# Altium project MSP1.PrjPcb
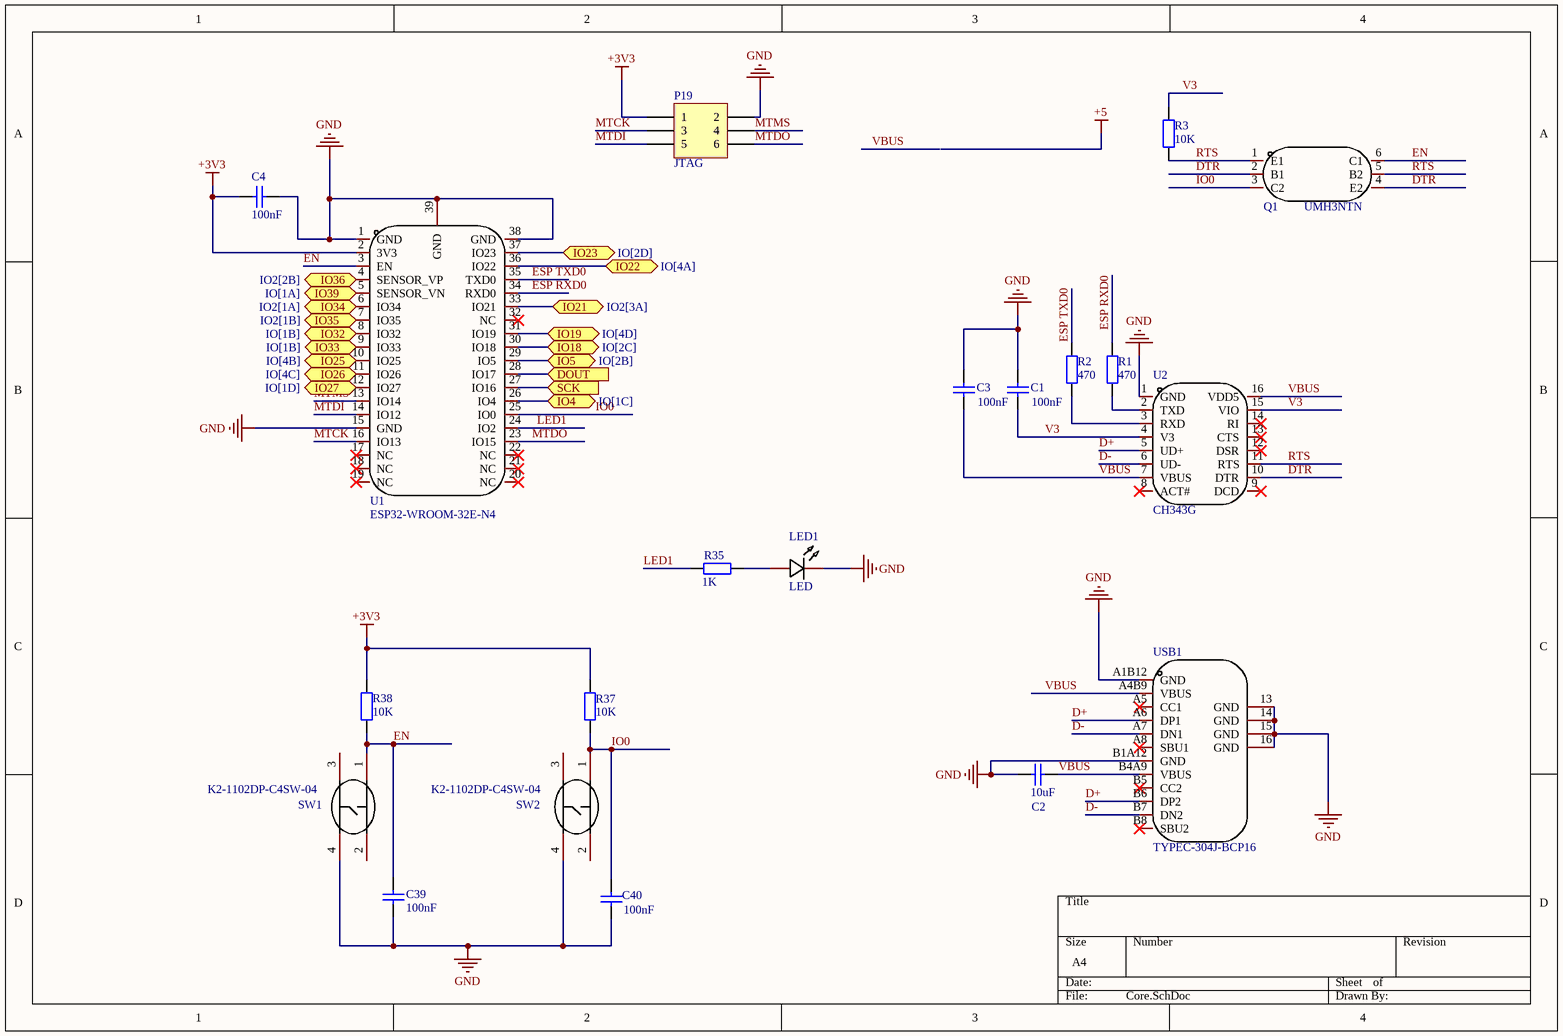
[diagram p0: Core.SchDoc]
5 sheets, 151 parts. Net scope: flat (ports and power ports of the same name join across sheets).
Board files: PCB1.PcbDoc, PCB2.PcbDoc
Sheets:
  Core.SchDoc
  Sensor.SchDoc
  Power.SchDoc
  IO.SchDoc
  IO2.SchDoc

## Sheet Core.SchDoc
size A4; SheetNumber: 1; SheetTotal: 5; SPICEModelCacheADNSXBRB: <root> / <DocumentId>ADNSXBRB</DocumentId> / </root>

### Parts
C1  value 100nF  [RAD-0.3]  (hidden comment: Cap)
C2  value 10uF  [RAD-0.3]  (hidden comment: Cap)
C3  value 100nF  [RAD-0.3]  (hidden comment: Cap)
C4  value 100nF  [RAD-0.3]  (hidden comment: Cap)
C39  value 100nF  [RAD-0.3]  (hidden comment: Cap)
C40  value 100nF  [RAD-0.3]  (hidden comment: Cap)
LED1  Name: LED  [LED-TH_BD5.0-P2.54-FD]  (hidden comment: HL-503S45FC)
P19  JTAG  [HDR2X3]
Q1  UMH3NTN  [SOT-363_L2.0-W1.3-P0.65-LS2.1-TL]
R1  value 470  [AXIAL-0.4]  (hidden comment: Res2)
R2  value 470  [AXIAL-0.4]  (hidden comment: Res2)
R3  value 10K  [AXIAL-0.4]  (hidden comment: Res2)
R35  value 1K  [AXIAL-0.4]  (hidden comment: Res2)
R37  value 10K  [AXIAL-0.4]  (hidden comment: Res2)
R38  value 10K  [AXIAL-0.4]  (hidden comment: Res2)
SW1  K2-1102DP-C4SW-04  [KEY-TH_4P-L6.0-W6.0-P4.50-LS6.50]
SW2  K2-1102DP-C4SW-04  [KEY-TH_4P-L6.0-W6.0-P4.50-LS6.50]
U1  ESP32-WROOM-32E-N4  [WIFI-SMD_ESP32-WROOM-32E]
U2  CH343G  [SOP-16_L10.0-W3.9-P1.27-LS6.0-BL]
USB1  TYPEC-304J-BCP16  [USB-C-SMD_TYPEC-304J-BCP16]

### Ports
DOUT (in, see Sensor[3A]), IO4 (bidir, see IO[1C]), IO5 (bidir, see IO[2B]), IO18 (bidir, see IO[2C]), IO19 (bidir, see IO[4D]), IO21 (bidir, see IO2[3A]), IO22 (bidir, see IO[4A]), IO23 (bidir, see IO[2D]), IO25 (bidir, see IO[4B]), IO26 (bidir, see IO[4C]), IO27 (bidir, see IO[1D]), IO32 (bidir, see IO[1B]), IO33 (bidir, see IO[1B]), IO34 (bidir, see IO2[1A]), IO35 (bidir, see IO2[1B]), IO36 (bidir, see IO2[2B]), IO39 (bidir, see IO[1A]), SCK (in, see Sensor[3A])

### Nets
+3V3: C4.2 P19.1 R37.2 R38.2 U1.2(3V3)
GND: C1.2 C2.2 C3.2 C4.1 C39.1 C40.1 LED1.2 P19.2 SW1.4 SW2.4 U1.1(GND) U1.15(GND) U1.38(GND) U1.39(GND) U2.1(GND) USB1.13(GND) USB1.14(GND) USB1.15(GND) USB1.16(GND) USB1.A1B12(GND) USB1.B1A12(GND)
D+: U2.5(UD+) USB1.A6(DP1) USB1.B6(DP2)
D-: U2.6(UD-) USB1.A7(DN1) USB1.B7(DN2)
DTR: Q1.2(B1) Q1.4(E2) U2.10(DTR)
EN: C39.2 Q1.6(C1) R38.1 SW1.1 U1.3(EN)
ESP RXD0: R1.2 U1.34(RXD0)
ESP TXD0: R2.2 U1.35(TXD0)
IO0: C40.2 Q1.3(C2) R37.1 SW2.1 U1.25(IO0)
LED1: R35.1 U1.24(IO2)
MTCK: P19.3 U1.16(IO13)
MTDI: P19.5 U1.14(IO12)
MTDO: P19.6 U1.23(IO15)
MTMS: P19.4 U1.13(IO14)
RTS: Q1.1(E1) Q1.5(B2) R3.1 U2.11(RTS)
V3: C1.1 R3.2 U2.4(V3) U2.15(VIO)
VBUS: C2.1 C3.1 U2.7(VBUS) U2.16(VDD5) USB1.A4B9(VBUS) USB1.B4A9(VBUS)
NetC33_2: U1.26(IO4) ; port IO4
NetC34_2: U1.12(IO27) ; port IO27
NetC35_2: U1.11(IO26) ; port IO26
NetC41_1: U1.36(IO22) ; port IO22
NetC42_1: U1.6(IO34) ; port IO34
NetC44_2: U1.7(IO35) ; port IO35
NetC45_2: U1.29(IO5) ; port IO5
NetC47_2: U1.37(IO23) ; port IO23
NetC51_2: U1.33(IO21) ; port IO21
NetLED1_1: LED1.1 R35.2
NetP5_1: U1.5(SENSOR_VN) ; port IO39
NetP6_1: U1.8(IO32) ; port IO32
NetP7_1: U1.9(IO33) ; port IO33
NetP14_1: U1.30(IO18) ; port IO18
NetP16_1: U1.10(IO25) ; port IO25
NetP18_1: U1.31(IO19) ; port IO19
NetP26_2: U1.4(SENSOR_VP) ; port IO36
NetR1_1: R1.1 U2.2(TXD)
NetR2_1: R2.1 U2.3(RXD)
NetU1_27: U1.27(IO16) ; port SCK
NetU1_28: U1.28(IO17) ; port DOUT

Not connected (* = marked no-connect by the designer): SW1 2 3; SW2 2 3; U1 17(NC)* 18(NC)* 19(NC)* 20(NC)* 21(NC)* 22(NC)* 32(NC)*; U2 8(ACT#)* 9(DCD)* 12(DSR)* 13(CTS)* 14(RI)*; USB1 A5(CC1)* A8(SBU1)* B5(CC2)* B8(SBU2)*

### Library data of the parts
C1-C4 C39 C40 = Cap: Capacitor; Published: 8-Jun-2000; LatestRevisionDate: 17-Jul-2002; LatestRevisionNote: Re-released for DXP Platform.; PackageReference: RAD-0.3; Publisher: Altium Limited; PackageDescription: Radial Cap, Thru-Hole; 2 Leads; 0.3 in Pin Spacing
LED1 = HL-503S45FC: Manufacturer: HONGLITRONIC(鸿利光电); Add into BOM: yes; Lamp Holder Type: 5mm圆形灯头; Emitted Color: 红色; Forward Voltage (VF): 2.2V; Power Dissipation: 66mW; Forward Current: 20mA; Dominant Wavelength: 617nm~627nm; Lens Color: 无色透明透镜; Luminous Intensity: 10750mcd; Viewing Angle: 15°; Symbol: HL-503S45FC; Device: HL-503S45FC; Supplier: LCSC; Supplier Part: C568942; Manufacturer Part: HL-503S45FC; JLCPCB Part Class: 扩展库; LCSC Part Name: HL-503S45FC; Supplier Footprint: 插件,D=5mm; Datasheet: https://atta.szlcsc.com/upload/public/pdf/source/20200630/C568942_DE1B88CAD7C81208DB145E6C2FD02F7C.pdf; Convert to PCB: yes; Peak Wavelength: -; Diode Configuration: -; Color Temperature: -; Mounting Sytle: -; Operating Temperature: -30℃~+80℃
P19 = Header 3X2: Header, 3-Pin, Dual row; LatestRevisionDate: 17-Jul-2002; LatestRevisionNote: Re-released for DXP Platform.; Publisher: Altium Limited
Q1 = UMH3NTN: Manufacturer: ROHM(罗姆); Add into BOM: yes; Collector-Emitter Breakdown Voltage (Vceo): 50V; Collector Current (Ic): 100mA; Power Dissipation (Pd): 150mW; DC Current Gain (hFE@Ic,Vce): 100@1mA,5V; Symbol: UMH3NTN; Device: UMH3NTN; LCSC Part Name: 耐压:50V 电流:100mA; Supplier Part: C123008; Manufacturer Part: UMH3NTN; Supplier Footprint: SOT-363; JLCPCB Part Class: 扩展库; Datasheet: https://atta.szlcsc.com/upload/public/pdf/source/20170726/C123008_1501054486996843958.pdf; Supplier: LCSC; Convert to PCB: yes; Transistor Type: -; Name: UMH3NTN
R1-R3 R35 R37 R38 = Res2: Resistor; Published: 8-Jun-2000; LatestRevisionDate: 17-Jul-2002; LatestRevisionNote: Re-released for DXP Platform.; PackageReference: AXIAL-0.4; Publisher: Altium Limited; PackageDescription: Axial Device, Thru-Hole; 2 Leads; 0.4 in Pin Spacing
SW1 SW2 = K2-1102DP-C4SW-04: Manufacturer: 韩国韩荣; Add into BOM: yes; Circuit: 单刀单掷; Actuator Style: 圆形按钮; Operating Force: 2.5N; Switch Length: 6mm; Switch Height: 5mm; Contact Current: 50mA; Voltage Rating (DC): 12V; Insulation Resistance: 100MΩ; Mechanical Life: 10万次; Symbol: K2-1102DP-C4SW-04; Device: K2-1102DP-C4SW-04; LCSC Part Name: 轻触按键开关6*6*5; Supplier Part: C110153; Manufacturer Part: K2-1102DP-C4SW-04; Supplier Footprint: 插件; JLCPCB Part Class: 扩展库; Datasheet: https://atta.szlcsc.com/upload/public/pdf/source/20210810/D0CD9D77408EACA829A5E533AC6E5B1E.pdf; Supplier: LCSC; Convert to PCB: yes; Mounting Style: 直插; Switch Width: 6mm; With Lamp: -; Operating Temperature: -25℃~+85℃; K2-1102DP-C4SW-04: K2-1102DP-C4SW-04
U1 = ESP32-WROOM-32E-N4: Manufacturer: ESPRESSIF(乐鑫); Symbol: ESP32-WROOM-32E(4MB); Add into BOM: yes; Device: ESP32-WROOM-32E-N4; LCSC Part Name: 通用型Wi-Fi+BT+BLE MCU模组; Supplier Part: C701341; Manufacturer Part: ESP32-WROOM-32E-N4; Supplier Footprint: SMD,18x25.5mm; JLCPCB Part Class: 扩展库; Datasheet: https://atta.szlcsc.com/upload/public/pdf/source/20220601/0020821B65DE5740BBACA5FACC5CF3B6.pdf; Supplier: LCSC; Convert to PCB: yes; ESP32-WROOM-32E-N4: ESP32-WROOM-32E-N4
U2 = CH343G: Manufacturer: WCH(南京沁恒); Add into BOM: yes; Symbol: CH343G; Device: CH343G; Supplier: LCSC; Supplier Part: C2844153; Manufacturer Part: CH343G; JLCPCB Part Class: 扩展库; LCSC Part Name: CH343G; Supplier Footprint: SOP-16; Datasheet: https://atta.szlcsc.com/upload/public/pdf/source/20211010/C2846043_7FA705E1F14A2906F6A2AFA45FA28209.pdf; Convert to PCB: yes; Applications Function: -; Protocol: -; Name: CH343G
USB1 = TYPEC-304J-BCP16: Manufacturer: XUNPU(讯普); Add into BOM: yes; Connector Type: Type-C; Gender: 母; Number of Ports: 1; Number of Contacts: 16P; Current Rating - Power (Max): 5A; Soldering Temperature(Max): 260℃; Symbol: TYPEC-304J-BCP16; Device: TYPEC-304J-BCP16; Supplier: LCSC; Supplier Part: C2835315; Manufacturer Part: TYPEC-304J-BCP16; JLCPCB Part Class: 扩展库; LCSC Part Name: Type-C 母 卧贴; Supplier Footprint: SMD; Datasheet: https://atta.szlcsc.com/upload/public/pdf/source/20210528/C2835315_A76BD3CF9329D12B6041421AD23BFD66.pdf; Convert to PCB: yes; Standard: USB 3.1; Mounting Style: 卧贴; Operating Temperature Range: -40℃~+85℃; Name: TYPEC-304J-BCP16

## Sheet Sensor.SchDoc
size A4; SheetNumber: 2; SheetTotal: 5; SPICEModelCacheXYVLXKKP: <root> / <DocumentId>XYVLXKKP</DocumentId> / <CacheFrame Number="0"> / <Model Name="2n3904" Kind="MDL"> / <Text>*2N3904 / *Si 310mW  40V 200mA 300MHz pkg:TO-92B 1,2,3 / .MODEL 2N3904 NPN(IS=1.4E-14 BF=300 VAF=100 IKF=0.025 ISE=3E-13 / + BR=7.5 RC=2.4 CJE=4.5E-12 TF=4E-10 CJC=3.5E-12 TR=2.1E-8 XTB=1.5 KF=9E-16 )</Text> / </Model> / </CacheFrame> / </root>
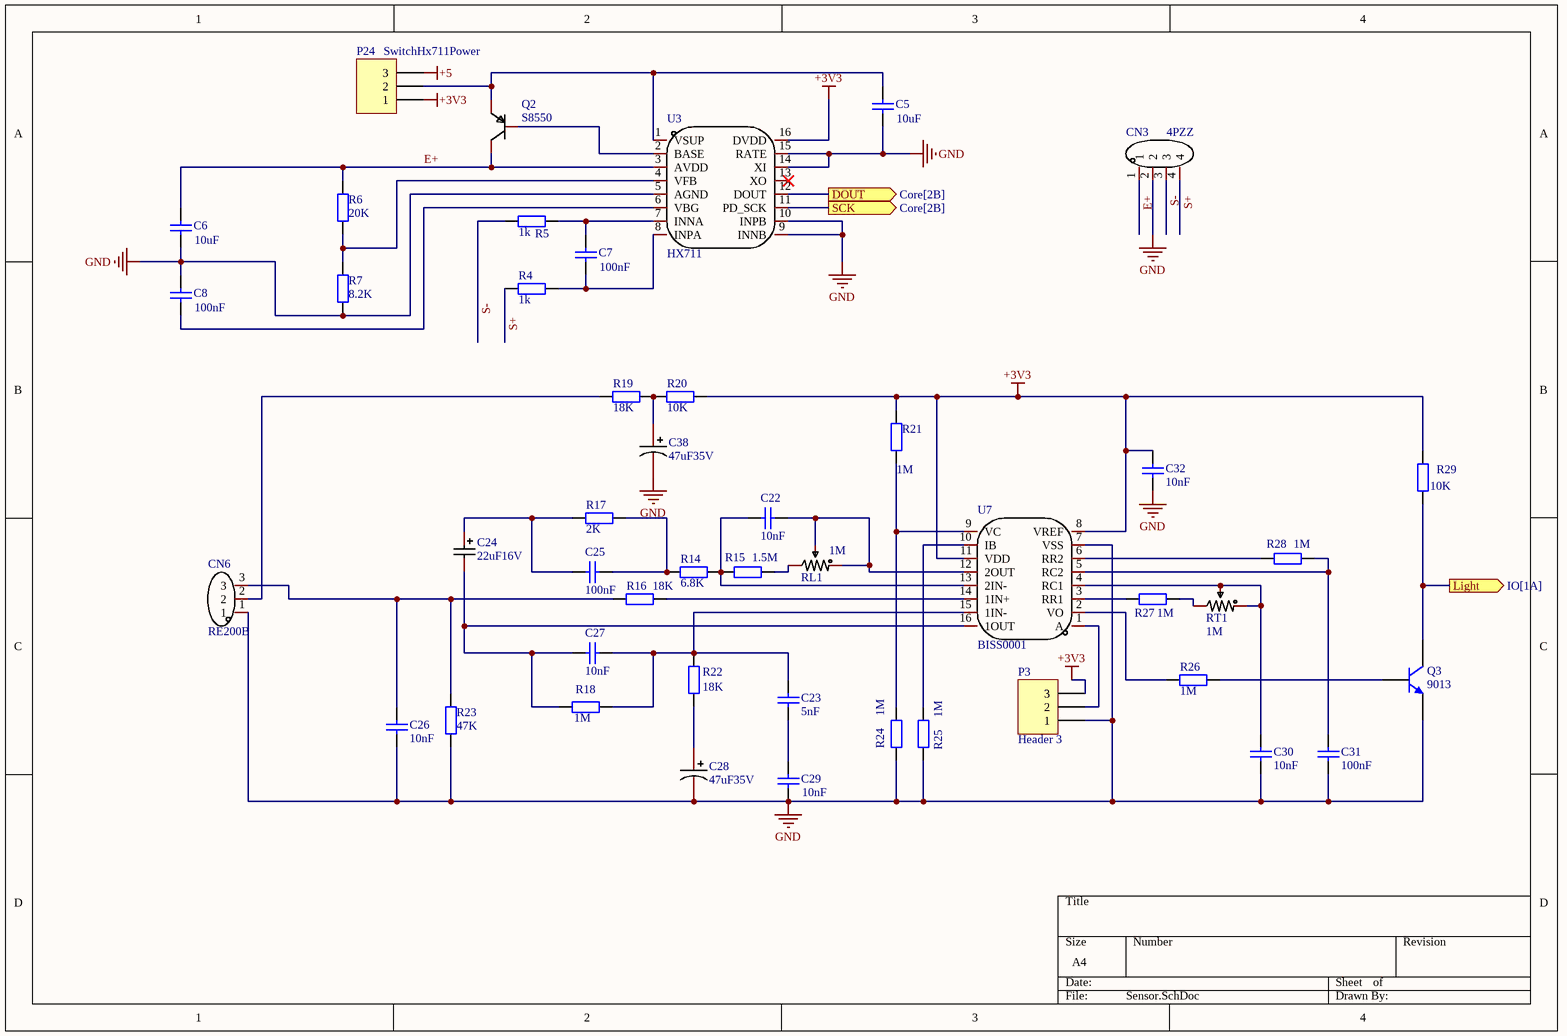
[diagram p1: Sensor.SchDoc]

### Parts
C5  value 10uF  [6-0805_N]  (hidden comment: Cap)
C6  value 10uF  [6-0805_N]  (hidden comment: Cap)
C7  value 100nF  [6-0805_N]  (hidden comment: Cap)
C8  value 100nF  [6-0805_N]  (hidden comment: Cap)
C22  value 10nF  [6-0805_N]  (hidden comment: Cap)
C23  value 5nF  [6-0805_N]  (hidden comment: Cap)
C24  Name: 22uF16V  [CASE-B_3528]  (hidden comment: 22uF)
C25  value 100nF  [6-0805_N]  (hidden comment: Cap)
C26  value 10nF  [6-0805_N]  (hidden comment: Cap)
C27  value 10nF  [6-0805_N]  (hidden comment: Cap)
C28  Name: 47uF35V  [CAP-TH_BD5.0-P2.00-D0.5-FD-A]  (hidden comment: 47uF)
C29  value 10nF  [6-0805_N]  (hidden comment: Cap)
C30  value 10nF  [6-0805_N]  (hidden comment: Cap)
C31  value 100nF  [6-0805_N]  (hidden comment: Cap)
C32  value 10nF  [6-0805_N]  (hidden comment: Cap)
C38  Name: 47uF35V  [CAP-TH_BD5.0-P2.00-D0.5-FD-A]  (hidden comment: 47uF)
CN3  Name: 4PZZ  [CONN-TH_4P-P2.50_4PIN]  (hidden comment: ZX-XH2.54-4PZZ)
CN6  Name: RE200B  [CONN-TH_3P-P2.54_2501S-3P]  (hidden comment: ZX-XH2.54-3PZZ)
P3  Header 3  [HDR1X3]
P24  SwitchHx711Power  [HDR1X3]
Q2  S8550  [SOT-23-3_L2.9-W1.3-P1.90-LS2.4-BR]
Q3  9013  [SOT-23-3_L2.9-W1.3-P1.90-LS2.4-BR]
R4  value 1k  [6-0805_N]  (hidden comment: Res2)
R5  value 1k  [6-0805_N]  (hidden comment: Res2)
R6  value 20K  [6-0805_N]  (hidden comment: Res2)
R7  value 8.2K  [6-0805_N]  (hidden comment: Res2)
R14  value 6.8K  [6-0805_N]  (hidden comment: Res2)
R15  value 1.5M  [6-0805_N]  (hidden comment: Res2)
R16  value 18K  [6-0805_N]  (hidden comment: Res2)
R17  value 2K  [6-0805_N]  (hidden comment: Res2)
R18  value 1M  [6-0805_N]  (hidden comment: Res2)
R19  value 18K  [6-0805_N]  (hidden comment: Res2)
R20  value 10K  [6-0805_N]  (hidden comment: Res2)
R21  value 1M  [6-0805_N]  (hidden comment: Res2)
R22  value 18K  [6-0805_N]  (hidden comment: Res2)
R23  value 47K  [6-0805_N]  (hidden comment: Res2)
R24  value 1M  [6-0805_N]  (hidden comment: Res2)
R25  value 1M  [6-0805_N]  (hidden comment: Res2)
R26  value 1M  [6-0805_N]  (hidden comment: Res2)
R27  value 1M  [6-0805_N]  (hidden comment: Res2)
R28  value 1M  [6-0805_N]  (hidden comment: Res2)
R29  value 10K  [6-0805_N]  (hidden comment: Res2)
RL1  Name: 1M  [RES-ADJ-TH_3P-L10.0-W10.0-P2.50-L]  (hidden comment: 10kΩ)
RT1  Name: 1M  [RES-ADJ-TH_3P-L10.0-W10.0-P2.50-L]  (hidden comment: 10kΩ)
U3  HX711  [SOP-16_L10.0-W3.9-P1.27-LS6.0-BL]
U7  BISS0001  [SOP-16_L10.0-W3.9-P1.27-LS6.0-BL]

### Ports
DOUT (out, see Core[2B]), Light (out, see IO[1A]), SCK (out, see Core[2B])

### Nets
+3V3: C32.1 P3.3 P24.1 R20.2 R21.1 R29.1 U3.16(DVDD) U7.8(VREF) U7.11(VDD)
+5: P24.3
GND: C5.1 C6.1 C8.2 C26.2 C28.2 C29.1 C30.2 C31.2 C32.2 C38.2 CN3.2 CN6.1 P3.1 Q3.1(E) R7.1 R23.2 R24.2 R25.2 U3.5(AGND) U3.9(INNB) U3.10(INPB) U3.14(XI) U3.15(RATE) U7.7(VSS)
E+: C6.2 CN3.1 Q2.3(C) R6.1 U3.3(AVDD)
S+: CN3.4 R4.2
S-: CN3.3 R5.2
NetC5_2: C5.2 P24.2 Q2.2(E) U3.1(VSUP)
NetC7_1: C7.1 R4.1 U3.8(INPA)
NetC7_2: C7.2 R5.1 U3.7(INNA)
NetC8_1: C8.1 U3.6(VBG)
NetC22_1: C22.1 R14.2 R15.1 U7.13(2IN-)
NetC22_2: C22.2 RL1.1 RL1.2 U7.12(2OUT)
NetC23_1: C23.1 C27.1 R18.1 R22.1 U7.15(1IN-)
NetC23_2: C23.2 C29.2
NetC24_1: C24.1 C25.1 R17.1
NetC24_2: C24.2 C27.2 R18.2 U7.16(1OUT)
NetC25_2: C25.2 R14.1 R17.2
NetC26_1: C26.1 CN6.3 R16.2 R23.1
NetC28_1: C28.1 R22.2
NetC30_1: C30.1 RT1.1 RT1.2 U7.4(RC1)
NetC31_1: C31.1 R28.2 U7.5(RC2)
NetC38_1: C38.1 R19.2 R20.1
NetCN6_2: CN6.2 R19.1
NetP3_2: P3.2 U7.1(A)
NetP5_2: Q3.3(C) R29.2 ; port Light
NetQ2_1: Q2.1(B) U3.2(BASE)
NetQ3_2: Q3.2(B) R26.2
NetR6_2: R6.2 R7.2 U3.4(VFB)
NetR15_2: R15.2 RL1.3
NetR16_1: R16.1 U7.14(1IN+)
NetR21_2: R21.2 R24.1 U7.9(VC)
NetR25_1: R25.1 U7.10(IB)
NetR26_1: R26.1 U7.2(VO)
NetR27_1: R27.1 U7.3(RR1)
NetR27_2: R27.2 RT1.3
NetR28_1: R28.1 U7.6(RR2)
NetU1_27: U3.11(PD_SCK) ; port SCK
NetU1_28: U3.12(DOUT) ; port DOUT

Not connected (* = marked no-connect by the designer): U3 13(XO)*

### Library data of the parts
C5-C8 C22 C23 C25-C27 C29-C32 = Cap: Capacitor; Published: 8-Jun-2000; LatestRevisionDate: 17-Jul-2002; LatestRevisionNote: Re-released for DXP Platform.; PackageReference: RAD-0.3; Publisher: Altium Limited; PackageDescription: Radial Cap, Thru-Hole; 2 Leads; 0.3 in Pin Spacing
C24 = TAJB226K016RNJ: Manufacturer: Kyocera AVX; Add into BOM: yes; Tolerance: ±10%; Rated Voltage: 16V; Equivalent Series Resistance(ESR): 2.3Ω@100kHz; Symbol: TAJB226K016RNJ; Device: TAJB226K016RNJ; LCSC Part Name: 22uF ±10% 16V; Supplier Part: C8020; Manufacturer Part: TAJB226K016RNJ; Supplier Footprint: CASE-B-3528; JLCPCB Part Class: 扩展库; Datasheet: https://atta.szlcsc.com/upload/public/pdf/source/20160107/1457707750344.pdf; Supplier: LCSC; Convert to PCB: yes; Value: 22uF; Operating Temperature: -55℃~+125℃
C28 C38 = 01EC1119: Manufacturer: KNSCHA(科尼盛); Add into BOM: yes; Tolerance: ±20%; Rated Voltage: 35V; Ripple Current: 135mA@100kHz; Equivalent Series Resistance(ESR): 1Ω@100kHz; φD: 5mm; L: 11mm; Lifetime @ Temp: 7000hrs@105℃; Symbol: 01EC1119; Device: 01EC1119; LCSC Part Name: 47uF ±20% 35V; Supplier Part: C2833295; Manufacturer Part: 01EC1119; Supplier Footprint: 插件,D5xL11mm; JLCPCB Part Class: 扩展库; Datasheet: https://atta.szlcsc.com/upload/public/pdf/source/20210521/C2833295_D5EF56CA4AAF67B2F3976F630DF1C3A7.pdf; Supplier: LCSC; Convert to PCB: yes; Value: 47uF; Lead Spacing: 2mm; Operating Temperature: -55℃~+105℃
CN3 = ZX-XH2.54-4PZZ: Manufacturer: Megastar(兆星); Add into BOM: yes; Pins Structure: 1x4P; Pitch: 2.54mm; Reference Series: XH; Number of PINs Per Row: 4; Current Rating (Max): 3A; Symbol: ZX-XH2.54-4PZZ; Device: ZX-XH2.54-4PZZ; LCSC Part Name: ZX-XH2.54-4PZZ; Supplier Part: C7429634; Manufacturer Part: ZX-XH2.54-4PZZ; Supplier Footprint: 插件,P=2.54mm; JLCPCB Part Class: 扩展库; Datasheet: https://atta.szlcsc.com/upload/public/pdf/source/20230619/B529A2163E0159A644AB3383D208FB03.pdf; Supplier: LCSC; Convert to PCB: yes; Mounting Style: 直插; Number of Pins: 4P; Number of Rows: 1; Row Spacing: -; Contact Material: 黄铜; Contact Plating: 锡; Operating Temperature Range: -25℃~+85℃
CN6 = ZX-XH2.54-3PZZ: Manufacturer: Megastar(兆星); Add into BOM: yes; Pins Structure: 1x3P; Pitch: 2.54mm; Reference Series: XH; Number of PINs Per Row: 3; Current Rating (Max): 3A; Symbol: ZX-XH2.54-3PZZ; Device: ZX-XH2.54-3PZZ; LCSC Part Name: ZX-XH2.54-3PZZ; Supplier Part: C7429633; Manufacturer Part: ZX-XH2.54-3PZZ; Supplier Footprint: 插件,P=2.54mm; JLCPCB Part Class: 扩展库; Datasheet: https://atta.szlcsc.com/upload/public/pdf/source/20230619/AE17037A2CFDBE8D9CBA775D61AD0A84.pdf; Supplier: LCSC; Convert to PCB: yes; Mounting Style: 直插; Number of Pins: 3P; Number of Rows: 1; Row Spacing: -; Contact Material: 黄铜; Contact Plating: 锡; Operating Temperature Range: -25℃~+85℃
P3 P24 = Header 3: Header, 3-Pin; LatestRevisionDate: 17-Jul-2002; LatestRevisionNote: Re-released for DXP Platform.; Publisher: Altium Limited
Q2 = S8550_C20069126: Manufacturer: 宏迦橙; Add into BOM: yes; Transistor Type: PNP; Collector Current (Ic): 500mA; Collector-Emitter Breakdown Voltage (Vceo): 25V; Power Dissipation (Pd): 300mW; DC Current Gain (hFE@Ic,Vce): 120@500mA,1.0V; Transition Frequency (fT): 150MHz; Collector Cut-Off Current (Icbo): 100nA; Collector-Emitter Saturation Voltage (VCE(sat)@Ic,Ib): 500mV@1.0A,50mA; Symbol: S8550_C20069126; Device: S8550_C20069126; LCSC Part Name: PNP 电流:500mA 耐压:25V; Supplier Part: C20069126; Manufacturer Part: S8550; Supplier Footprint: SOT-23; JLCPCB Part Class: 扩展库; Datasheet: https://atta.szlcsc.com/upload/public/pdf/source/20231229/A44F382554E15234B24C32D7C3971EED.pdf; Supplier: LCSC; Convert to PCB: yes; Operating Temperature: -55℃~+150℃; Name: S8550
Q3 = 2N3904: NPN General Purpose Amplifier; Published: 8-Jun-2000; LatestRevisionDate: 15-Jan-2003; LatestRevisionNote: PCB Footprint 'BCY-W3/D4.7' replaced; DatasheetVersion: 1997; PackageVersion: Sep-1998; PackageReference: TO-92A; Publisher: Altium Limited; PackageDescription: TO, Flat Index; 3 In-Line, Axial Leads; Body Dia. 4.5mm; Leads 0.51 x 0.48 mm (max); ComponentLink1Description: Manufacturer Link; ComponentLink1URL: http://www.fairchildsemi.com/; ComponentLink2Description: Datasheet; ComponentLink2URL: http://www.fairchildsemi.com/ds/2N%2F2N3904.pdf
R4-R7 R14-R29 = Res2: Resistor; Published: 8-Jun-2000; LatestRevisionDate: 17-Jul-2002; LatestRevisionNote: Re-released for DXP Platform.; PackageReference: AXIAL-0.4; Publisher: Altium Limited; PackageDescription: Axial Device, Thru-Hole; 2 Leads; 0.4 in Pin Spacing
RL1 RT1 = 3296W-1-103: Manufacturer: BOCHEN(博晨); Add into BOM: yes; Tolerance: ±10%; Symbol: 3296W-1-103; Device: 3296W-1-103; LCSC Part Name: 10kΩ ±10%; Supplier Part: C118954; Manufacturer Part: 3296W-1-103; Supplier Footprint: 插件; JLCPCB Part Class: 扩展库; Datasheet: https://atta.szlcsc.com/upload/public/pdf/source/20171114/C118954_15106326646611117443.pdf; Supplier: LCSC; Convert to PCB: yes; Value: 10kΩ
U3 = HX711_C6705483: Manufacturer: AVIA(海芯科技); Add into BOM: yes; Symbol: HX711_C6705483; Device: HX711_C6705483; LCSC Part Name: HX711; Supplier Part: C6705483; Manufacturer Part: HX711; Supplier Footprint: SOP-16; JLCPCB Part Class: 扩展库; Supplier: LCSC; Convert to PCB: yes; Name: HX711
U7 = BISS0001: Manufacturer: UMW(友台半导体); Symbol: BISS0001_C404323; Add into BOM: yes; Device: BISS0001; LCSC Part Name: 红外传感信号处理器; Supplier Part: C404323; Manufacturer Part: BISS0001; Supplier Footprint: SOP-16; JLCPCB Part Class: 扩展库; Datasheet: https://atta.szlcsc.com/upload/public/pdf/source/20231109/48CCA2F2187B39D45C76AC1FEDDCACA0.pdf; Supplier: LCSC; Convert to PCB: yes; Name: BISS0001

## Sheet Power.SchDoc
size A4; SheetNumber: 3; SheetTotal: 5; SPICEModelCacheQNSYMEED: <root> / <DocumentId>QNSYMEED</DocumentId> / </root>
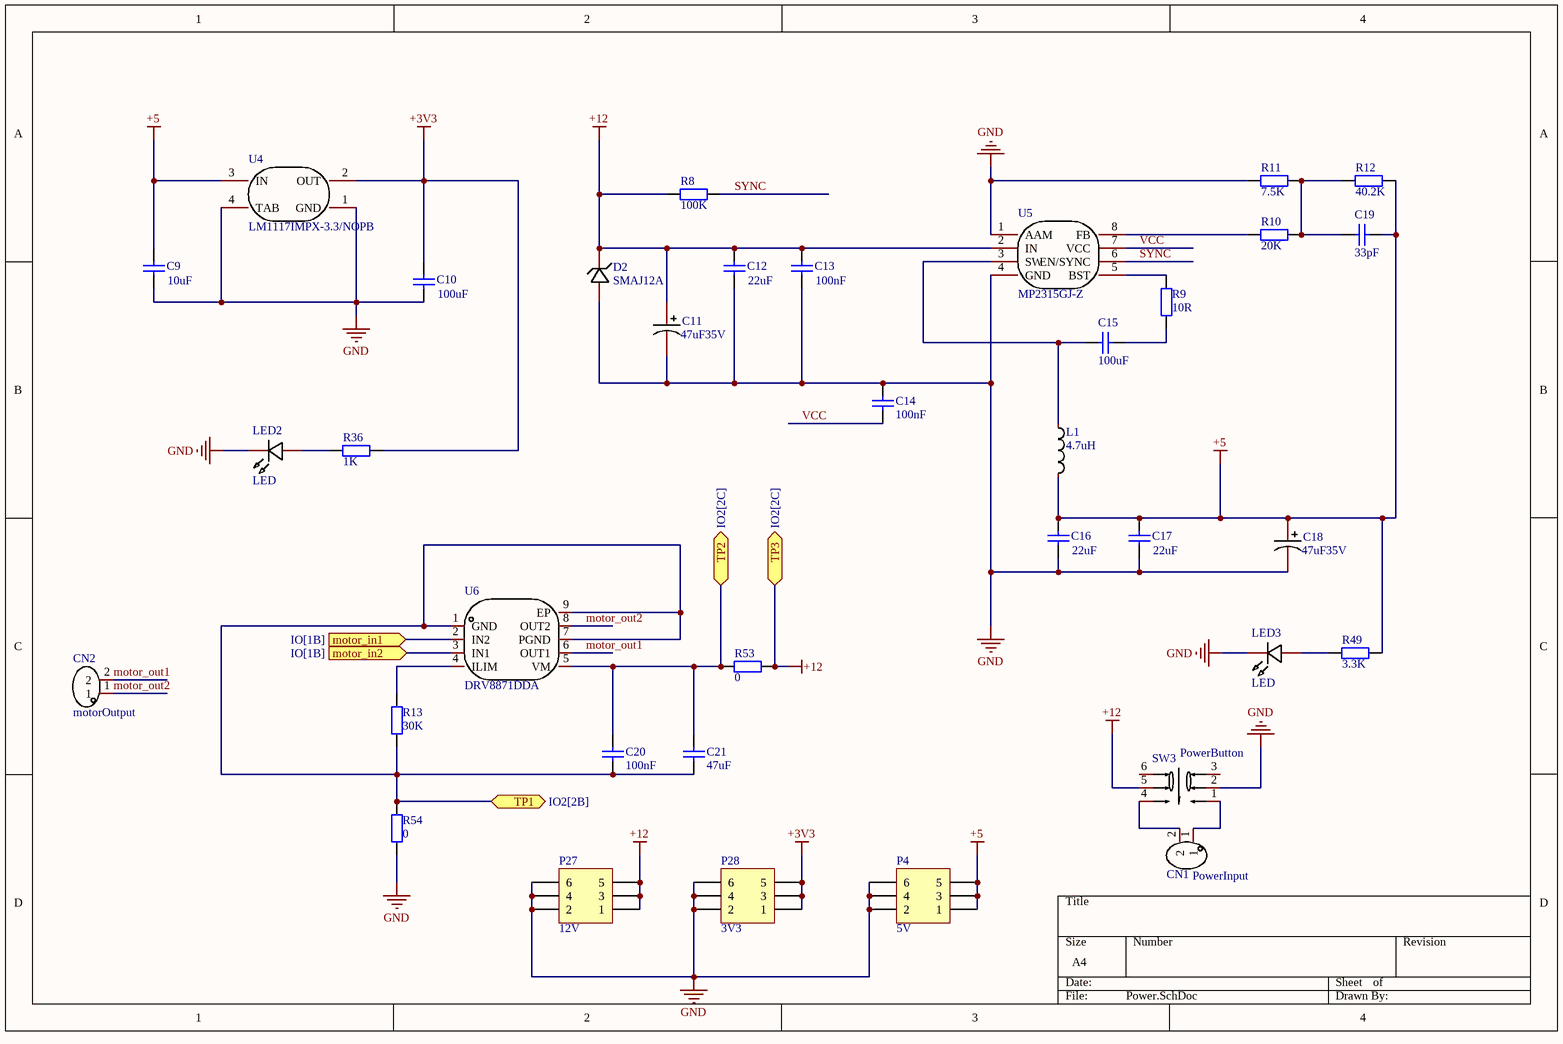
[diagram p2: Power.SchDoc]

### Parts
C9  value 10uF  [RAD-0.3]  (hidden comment: Cap)
C10  value 100uF  [RAD-0.3]  (hidden comment: Cap)
C11  Name: 47uF35V  [CAP-TH_BD5.0-P2.00-D0.5-FD-A]  (hidden comment: 47uF)
C12  value 22uF  [RAD-0.3]  (hidden comment: Cap)
C13  value 100nF  [RAD-0.3]  (hidden comment: Cap)
C14  value 100nF  [RAD-0.3]  (hidden comment: Cap)
C15  value 100uF  [RAD-0.3]  (hidden comment: Cap)
C16  value 22uF  [RAD-0.3]  (hidden comment: Cap)
C17  value 22uF  [RAD-0.3]  (hidden comment: Cap)
C18  Name: 47uF35V  [CAP-TH_BD5.0-P2.00-D0.5-FD-A]  (hidden comment: 47uF)
C19  value 33pF  [RAD-0.3]  (hidden comment: Cap)
C20  value 100nF  [RAD-0.3]  (hidden comment: Cap)
C21  value 47uF  [RAD-0.3]  (hidden comment: Cap)
CN1  MX126-5.0-02P-GN01-Cu-S-A: PowerInput  [CONN-TH_2P-P5.00_MX126-5.0-GN01-02P-CU-S-A]  (hidden comment: MX126-5.0-02P-GN01-Cu-S-A)
CN2  MX126-5.0-02P-GN01-Cu-S-A: motorOutput  [CONN-TH_2P-P5.00_MX126-5.0-GN01-02P-CU-S-A]  (hidden comment: MX126-5.0-02P-GN01-Cu-S-A)
D2  SMAJ12A  [SMA_L4.3-W2.6-LS5.2-RD]
L1  4.7uH  [IND-SMD_L5.4-W5.2_FXL0530]
LED2  Name: LED  [LED-TH_BD5.0-P2.54-FD]  (hidden comment: HL-503S45FC)
LED3  Name: LED  [LED-TH_BD5.0-P2.54-FD]  (hidden comment: HL-503S45FC)
P4  5V  [HDR2X3]
P27  12V  [HDR2X3]
P28  3V3  [HDR2X3]
R8  value 100K  [AXIAL-0.4]  (hidden comment: Res2)
R9  value 10R  [AXIAL-0.4]  (hidden comment: Res2)
R10  value 20K  [AXIAL-0.4]  (hidden comment: Res2)
R11  value 7.5K  [AXIAL-0.4]  (hidden comment: Res2)
R12  value 40.2K  [AXIAL-0.4]  (hidden comment: Res2)
R13  value 30K  [AXIAL-0.4]  (hidden comment: Res2)
R36  value 1K  [AXIAL-0.4]  (hidden comment: Res2)
R49  value 3.3K  [AXIAL-0.4]  (hidden comment: Res2)
R53  value 0  [AXIAL-0.4]  (hidden comment: Res2)
R54  value 0  [AXIAL-0.4]  (hidden comment: Res2)
SW3  XKB7070-Z: PowerButton  [SW-TH_6P-L7.0-W7.0-P2.00]  (hidden comment: XKB7070-Z)
U4  LM1117IMPX-3.3/NOPB  [SOT-223_L6.5-W3.5-P2.30-LS7.0-BR]
U5  MP2315GJ-Z  [TSOT-23-8_L2.9-W1.6-P0.65-LS2.8-BR]
U6  DRV8871DDA  [POWERPAD-SO-8_L4.9-W3.9-P1.27-LS6.0-BL-EP]

### Ports
motor_in1 (in, see IO[1B]), motor_in2 (in, see IO[1B]), TP1 (bidir, see IO2[2B]), TP2 (bidir, see IO2[2C]), TP3 (bidir, see IO2[2C])

### Nets
+3V3: C10.2 P28.1 P28.3 P28.5 R36.1 U4.2(OUT)
+5: C9.2 C16.2 C17.2 C18.1 C19.2 L1.2 P4.1 P4.3 P4.5 R12.2 R49.1 U4.3(IN)
+12: C11.1 C12.2 C13.2 D2.1(C) P27.1 P27.3 P27.5 R8.2 R53.2 SW3.5 U5.2(IN) ; port TP3
GND: C9.1 C10.1 C11.2 C12.1 C13.1 C14.1 C16.1 C17.1 C18.2 D2.2(A) LED2.2 LED3.2 P4.2 P4.4 P4.6 P27.2 P27.4 P27.6 P28.2 P28.4 P28.6 R11.1 R54.1 SW3.2 U4.1(GND) U4.4(TAB) U5.1(AAM) U5.4(GND)
motor_out1: CN2.2 U6.6(OUT1)
motor_out2: CN2.1 U6.8(OUT2)
SYNC: R8.1 U5.6(EN/SYNC)
VCC: C14.2 U5.7(VCC)
NetC15_1: C15.1 L1.1 U5.3(SW)
NetC15_2: C15.2 R9.2
NetC19_1: C19.1 R10.2 R11.2 R12.1
NetC20_1: C20.1 C21.1 R53.1 U6.5(VM) ; port TP2
NetC20_2: C20.2 C21.2 R13.2 R54.2 U6.1(GND) U6.7(PGND) U6.9(EP) ; port TP1
NetCN1_1: CN1.1 SW3.1
NetCN1_2: CN1.2 SW3.4
NetLED2_1: LED2.1 R36.2
NetLED3_1: LED3.1 R49.2
NetP6_2: U6.2(IN2) ; port motor_in1
NetP7_2: U6.3(IN1) ; port motor_in2
NetR9_1: R9.1 U5.5(BST)
NetR10_1: R10.1 U5.8(FB)
NetR13_1: R13.1 U6.4(ILIM)

Not connected (* = marked no-connect by the designer): SW3 3 6

### Library data of the parts
C9 C10 C12-C17 C19-C21 = Cap: Capacitor; Published: 8-Jun-2000; LatestRevisionDate: 17-Jul-2002; LatestRevisionNote: Re-released for DXP Platform.; PackageReference: RAD-0.3; Publisher: Altium Limited; PackageDescription: Radial Cap, Thru-Hole; 2 Leads; 0.3 in Pin Spacing
C11 C18 = 01EC1119: as C28 on sheet Sensor; Symbol: 01EC1119; Device: 01EC1119; LCSC Part Name: 47uF ±20% 35V; Supplier Part: C2833295; Manufacturer Part: 01EC1119; Supplier Footprint: 插件,D5xL11mm; JLCPCB Part Class: 扩展库; Datasheet: https://atta.szlcsc.com/upload/public/pdf/source/20210521/C2833295_D5EF56CA4AAF67B2F3976F630DF1C3A7.pdf; Supplier: LCSC; Convert to PCB: yes; Value: 47uF; Lead Spacing: 2mm; Operating Temperature: -55℃~+105℃
CN1 CN2 = MX126-5.0-02P-GN01-Cu-S-A: Manufacturer: MAX(迈旭); Symbol: MX126-5.0-GN01-02P-CU-S-A; Add into BOM: yes; Structure: 1x2P; Pitch: 5mm; Current Rating (Max): 10A; Voltage Rating (Max): 300V; Wire Gauge - AWG: 14~26; Wire Gauge - mm2: 2.5; Number of PINs Per Row: 2; Device: MX126-5.0-02P-GN01-Cu-S-A; LCSC Part Name: 5mm 1x2P 排数:1 每排P数:2 直插; Supplier Part: C5188434; Manufacturer Part: MX126-5.0-02P-GN01-Cu-S-A; Supplier Footprint: 插件,P=5mm; JLCPCB Part Class: 扩展库; Datasheet: https://atta.szlcsc.com/upload/public/pdf/source/20230914/2B012B5258BE925E2417FA81B30CB923.pdf; Supplier: LCSC; Convert to PCB: yes; Color: 绿色; Mounting Style: 直插; Number of Pins: 2P; Number of Rows: 1; Contact Material: 铜合金; Contact Plating: 锡; Operating Temperature Range: -40℃~+105℃
D2 = SMAJ12A_C148213: Manufacturer: Littelfuse(美国力特); Symbol: SMAJ12A-C148213; Add into BOM: yes; polarity: 单向; Reverse Stand-Off Voltage (Vrwm): 12V; Maximum Clamping Voltage: 19.9V; Peak Pulse Current (Ipp)@10/1000us: 20.1A; Peak Pulse Power Dissipation (Ppp)@10/1000us: 400W; Breakdown Voltage: 13.3V; Type: TVS; Device: SMAJ12A_C148213; LCSC Part Name: 单向TVS 12V截止; Supplier Part: C148213; Manufacturer Part: SMAJ12A; Supplier Footprint: SMA(DO-214AC); JLCPCB Part Class: 扩展库; Datasheet: https://atta.szlcsc.com/upload/public/pdf/source/20190402/C374025_5ACE77BC72947DF13CF0CBC7F8B57228.pdf; Supplier: LCSC; Convert to PCB: yes; Name: SMAJ12A
L1 = FXL0530-4R7-M: Manufacturer: cjiang(长江微电); Add into BOM: yes; Tolerance: ±20%; Rated Current: 4.5A; Saturation Current (Isat): 5A; DC Resistance (DCR): 60mΩ; Type: 一体成型电感; Symbol: FXL0530-4R7-M; Device: FXL0530-4R7-M; LCSC Part Name: 4.7uH ±20% 5A; Supplier Part: C177246; Manufacturer Part: FXL0530-4R7-M; Supplier Footprint: SMD,5.2x5.4mm; JLCPCB Part Class: 扩展库; Datasheet: https://atta.szlcsc.com/upload/public/pdf/source/20240426/3189EA8206330E2108542F9E34E540E7.pdf; Supplier: LCSC; Convert to PCB: yes; Value: 4.7uH; 4R7: 4.7uH
LED2 LED3 = HL-503S45FC: as LED1 on sheet Core; Symbol: HL-503S45FC; Device: HL-503S45FC; Supplier: LCSC; Supplier Part: C568942; Manufacturer Part: HL-503S45FC; JLCPCB Part Class: 扩展库; LCSC Part Name: HL-503S45FC; Supplier Footprint: 插件,D=5mm; Datasheet: https://atta.szlcsc.com/upload/public/pdf/source/20200630/C568942_DE1B88CAD7C81208DB145E6C2FD02F7C.pdf; Convert to PCB: yes; Peak Wavelength: -; Diode Configuration: -; Color Temperature: -; Mounting Sytle: -; Operating Temperature: -30℃~+80℃
P4 P27 P28 = Header 3X2: Header, 3-Pin, Dual row; LatestRevisionDate: 17-Jul-2002; LatestRevisionNote: Re-released for DXP Platform.; Publisher: Altium Limited
R8-R13 R36 R49 R53 R54 = Res2: Resistor; Published: 8-Jun-2000; LatestRevisionDate: 17-Jul-2002; LatestRevisionNote: Re-released for DXP Platform.; PackageReference: AXIAL-0.4; Publisher: Altium Limited; PackageDescription: Axial Device, Thru-Hole; 2 Leads; 0.4 in Pin Spacing
SW3 = XKB7070-Z: Manufacturer: XKB Connectivity(中国星坤); Add into BOM: yes; Self Lock / No Lock: 自锁; Actuator Style: 矩形按钮; Contact Current: 100mA; Voltage Rating (AC): 250V; Voltage Rating (DC): 30V; Insulation Resistance: 100MΩ; Actuator/Cap Color: 蓝色; With Lamp: 不带; Pin Style: PC引脚; Operating Force: 160gf; Mechanical Life: 10万次; Symbol: XKB7070-Z; Device: XKB7070-Z; Supplier: LCSC; Supplier Part: C318863; Manufacturer Part: XKB7070-Z; JLCPCB Part Class: 扩展库; LCSC Part Name: 按键开关   7*7插件自锁 蓝白黑; Supplier Footprint: 插件; Datasheet: https://atta.szlcsc.com/upload/public/pdf/source/20211015/75A682A27A424BDE8D93C2CFA14C38FE.pdf; Convert to PCB: yes; IP Rating: -; Mounting Style: 直插; Operating Temperature: -15℃~+55℃
U4 = LM1117IMPX-3.3/NOPB: Manufacturer: TI(德州仪器); Add into BOM: yes; Output Type: 固定; Maximum Input Voltage: 15V; Output Voltage: 3.3V; MAX Output Current: 800mA; Power Supply Rejection Ratio (PSRR): 75dB@(120Hz); Dropout Voltage: 1.2V@(800mA); standby current: 5mA; Output Polarity: 正极; Number of Outputs: 1; Symbol: LM1117IMPX-3.3/NOPB; Device: LM1117IMPX-3.3/NOPB; LCSC Part Name: 输入20V 输出3.3V 800mA; Supplier Part: C23984; Manufacturer Part: LM1117IMPX-3.3/NOPB; Supplier Footprint: SOT-223; JLCPCB Part Class: 扩展库; Datasheet: http://www.ti.com/cn/lit/gpn/lm1117; Supplier: LCSC; Convert to PCB: yes; Operating Temperature: -40℃~+125℃; Name: LM1117IMPX-3.3/NOPB
U5 = MP2315GJ-Z: Manufacturer: MPS(芯源); Add into BOM: yes; Function: 降压型; Output Type: 可调; Input Voltage: 4.5V~24V; Output Voltage: 800mV~22.8V; Output Current (Max): 3A; Switching Frequency: 500kHz; Synchronous Rectification: 是; Number of Outputs: 1; Topology: 降压式; Switch tube (built-in/external): 内置; Symbol: MP2315GJ-Z; Device: MP2315GJ-Z; LCSC Part Name: MP2315GJ-Z; Supplier Part: C45889; Manufacturer Part: MP2315GJ-Z; Supplier Footprint: TSOT-23-8; JLCPCB Part Class: 扩展库; Datasheet: https://atta.szlcsc.com/upload/public/pdf/source/20240315/E986BDF075E08D3649664A84BD5F173B.pdf; Supplier: LCSC; Convert to PCB: yes; Operating Temperature: -40℃~+125℃@(TJ); Name: MP2315GJ-Z
U6 = DRV8871DDA: Manufacturer: TI(德州仪器); Add into BOM: yes; Symbol: DRV8871DDA; Device: DRV8871DDA; LCSC Part Name: DRV8871DDA; Supplier Part: C1556867; Manufacturer Part: DRV8871DDA; Supplier Footprint: SO-8-EP; JLCPCB Part Class: 扩展库; Datasheet: https://www.ti.com/cn/lit/gpn/drv8871; Supplier: LCSC; Convert to PCB: yes; Name: DRV8871DDA

## Sheet IO.SchDoc
size A4; SheetNumber: 4; SheetTotal: 5; SPICEModelCacheOQHKHOHZ: <root> / <DocumentId>OQHKHOHZ</DocumentId> / <CacheFrame Number="0"> / <Model Name="2n3904" Kind="MDL"> / <Text>*2N3904 / *Si 310mW  40V 200mA 300MHz pkg:TO-92B 1,2,3 / .MODEL 2N3904 NPN(IS=1.4E-14 BF=300 VAF=100 IKF=0.025 ISE=3E-13 / + BR=7.5 RC=2.4 CJE=4.5E-12 TF=4E-10 CJC=3.5E-12 TR=2.1E-8 XTB=1.5 KF=9E-16 )</Text> / </Model> / </CacheFrame> / </root>
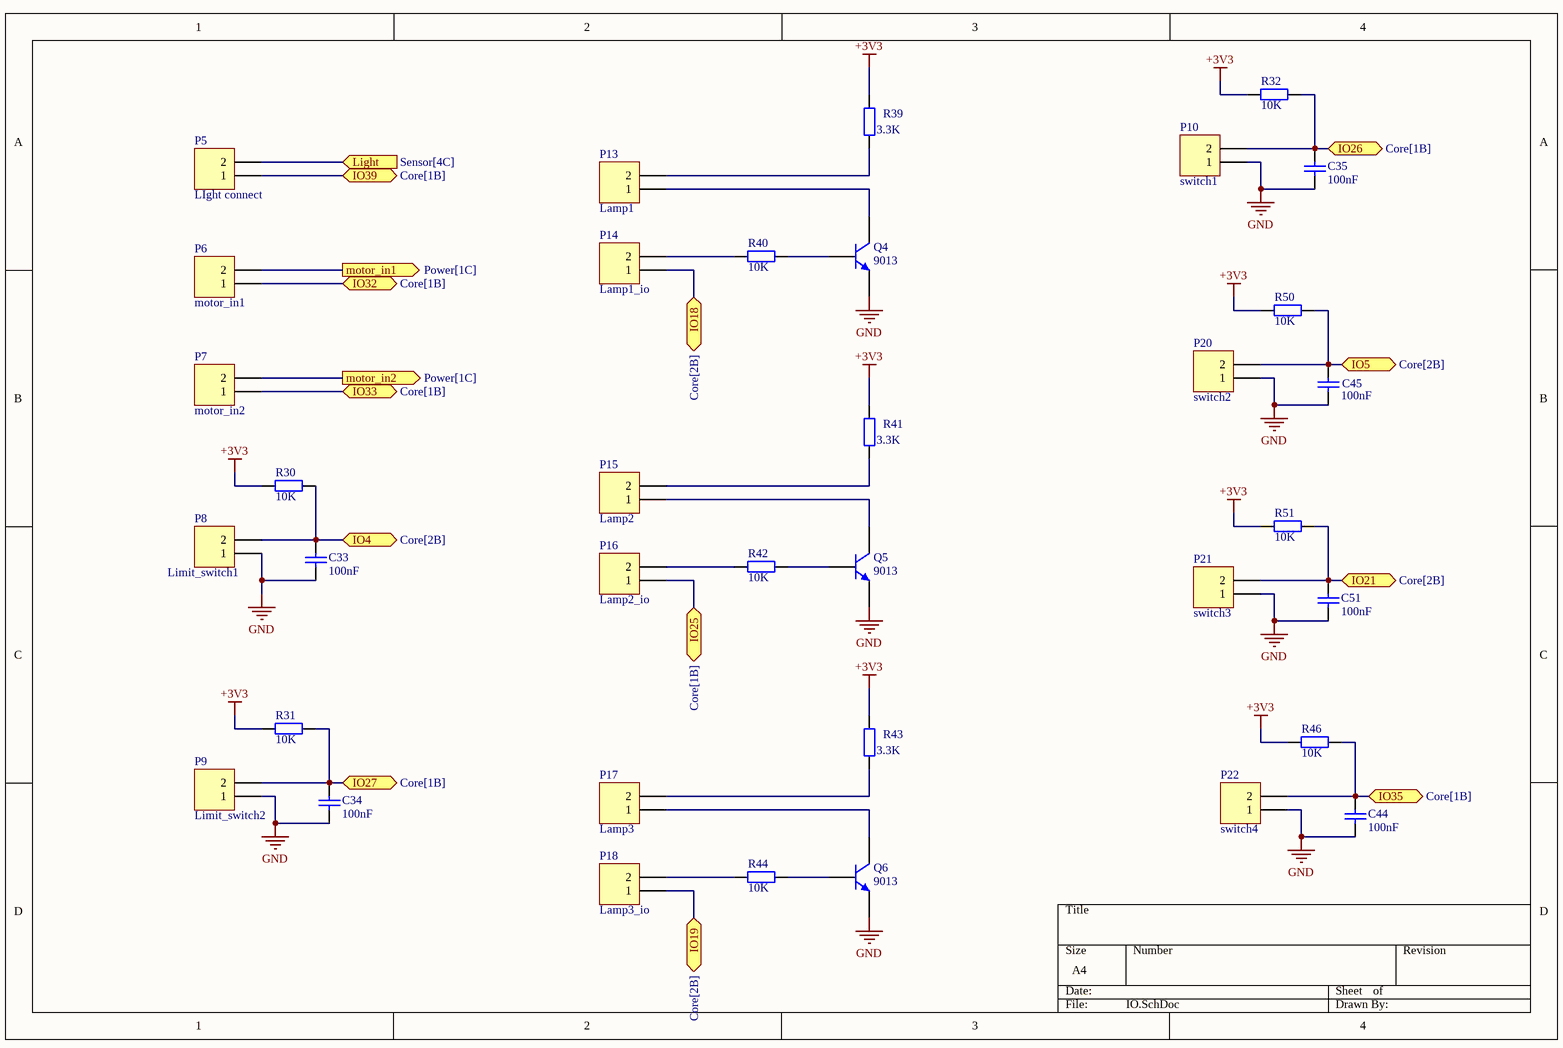
[diagram p3: IO.SchDoc]

### Parts
C33  value 100nF  [6-0805_N]  (hidden comment: Cap)
C34  value 100nF  [6-0805_N]  (hidden comment: Cap)
C35  value 100nF  [6-0805_N]  (hidden comment: Cap)
C44  value 100nF  [6-0805_N]  (hidden comment: Cap)
C45  value 100nF  [6-0805_N]  (hidden comment: Cap)
C51  value 100nF  [6-0805_N]  (hidden comment: Cap)
P5  LIght connect  [HDR1X2]
P6  motor_in1  [HDR1X2]
P7  motor_in2  [HDR1X2]
P8  Limit_switch1  [HDR1X2]
P9  Limit_switch2  [HDR1X2]
P10  switch1  [HDR1X2]
P13  Lamp1  [HDR1X2]
P14  Lamp1_io  [HDR1X2]
P15  Lamp2  [HDR1X2]
P16  Lamp2_io  [HDR1X2]
P17  Lamp3  [HDR1X2]
P18  Lamp3_io  [HDR1X2]
P20  switch2  [HDR1X2]
P21  switch3  [HDR1X2]
P22  switch4  [HDR1X2]
Q4  9013  [SOT-23-3_L2.9-W1.3-P1.90-LS2.4-BR]
Q5  9013  [SOT-23-3_L2.9-W1.3-P1.90-LS2.4-BR]
Q6  9013  [SOT-23-3_L2.9-W1.3-P1.90-LS2.4-BR]
R30  value 10K  [6-0805_N]  (hidden comment: Res2)
R31  value 10K  [6-0805_N]  (hidden comment: Res2)
R32  value 10K  [6-0805_N]  (hidden comment: Res2)
R39  value 3.3K  [6-0805_N]  (hidden comment: Res2)
R40  value 10K  [6-0805_N]  (hidden comment: Res2)
R41  value 3.3K  [6-0805_N]  (hidden comment: Res2)
R42  value 10K  [6-0805_N]  (hidden comment: Res2)
R43  value 3.3K  [6-0805_N]  (hidden comment: Res2)
R44  value 10K  [6-0805_N]  (hidden comment: Res2)
R46  value 10K  [6-0805_N]  (hidden comment: Res2)
R50  value 10K  [6-0805_N]  (hidden comment: Res2)
R51  value 10K  [6-0805_N]  (hidden comment: Res2)

### Ports
IO4 (bidir, see Core[2B]), IO5 (bidir, see Core[2B]), IO18 (bidir, see Core[2B]), IO19 (bidir, see Core[2B]), IO21 (bidir, see Core[2B]), IO25 (bidir, see Core[1B]), IO26 (bidir, see Core[1B]), IO27 (bidir, see Core[1B]), IO32 (bidir, see Core[1B]), IO33 (bidir, see Core[1B]), IO35 (bidir, see Core[1B]), IO39 (bidir, see Core[1B]), Light (in, see Sensor[4C]), motor_in1 (out, see Power[1C]), motor_in2 (out, see Power[1C])

### Nets
+3V3: R30.1 R31.1 R32.1 R39.1 R41.1 R43.1 R46.1 R50.1 R51.1
GND: C33.1 C34.1 C35.1 C44.1 C45.1 C51.1 P8.1 P9.1 P10.1 P20.1 P21.1 P22.1 Q4.1(E) Q5.1(E) Q6.1(E)
NetC33_2: C33.2 P8.2 R30.2 ; port IO4
NetC34_2: C34.2 P9.2 R31.2 ; port IO27
NetC35_2: C35.2 P10.2 R32.2 ; port IO26
NetC44_2: C44.2 P22.2 R46.2 ; port IO35
NetC45_2: C45.2 P20.2 R50.2 ; port IO5
NetC51_2: C51.2 P21.2 R51.2 ; port IO21
NetP5_1: P5.1 ; port IO39
NetP5_2: P5.2 ; port Light
NetP6_1: P6.1 ; port IO32
NetP6_2: P6.2 ; port motor_in1
NetP7_1: P7.1 ; port IO33
NetP7_2: P7.2 ; port motor_in2
NetP13_1: P13.1 Q4.3(C)
NetP13_2: P13.2 R39.2
NetP14_1: P14.1 ; port IO18
NetP14_2: P14.2 R40.1
NetP15_1: P15.1 Q5.3(C)
NetP15_2: P15.2 R41.2
NetP16_1: P16.1 ; port IO25
NetP16_2: P16.2 R42.1
NetP17_1: P17.1 Q6.3(C)
NetP17_2: P17.2 R43.2
NetP18_1: P18.1 ; port IO19
NetP18_2: P18.2 R44.1
NetQ4_2: Q4.2(B) R40.2
NetQ5_2: Q5.2(B) R42.2
NetQ6_2: Q6.2(B) R44.2

### Library data of the parts
C33-C35 C44 C45 C51 = Cap: Capacitor; Published: 8-Jun-2000; LatestRevisionDate: 17-Jul-2002; LatestRevisionNote: Re-released for DXP Platform.; PackageReference: RAD-0.3; Publisher: Altium Limited; PackageDescription: Radial Cap, Thru-Hole; 2 Leads; 0.3 in Pin Spacing
P5-P10 P13-P18 P20-P22 = Header 2: Header, 2-Pin; LatestRevisionDate: 17-Jul-2002; LatestRevisionNote: Re-released for DXP Platform.; Publisher: Altium Limited
Q4-Q6 = 2N3904: NPN General Purpose Amplifier; Published: 8-Jun-2000; LatestRevisionDate: 15-Jan-2003; LatestRevisionNote: PCB Footprint 'BCY-W3/D4.7' replaced; DatasheetVersion: 1997; PackageVersion: Sep-1998; PackageReference: TO-92A; Publisher: Altium Limited; PackageDescription: TO, Flat Index; 3 In-Line, Axial Leads; Body Dia. 4.5mm; Leads 0.51 x 0.48 mm (max); ComponentLink1Description: Manufacturer Link; ComponentLink1URL: http://www.fairchildsemi.com/; ComponentLink2Description: Datasheet; ComponentLink2URL: http://www.fairchildsemi.com/ds/2N%2F2N3904.pdf
R30-R32 R39-R44 R46 R50 R51 = Res2: Resistor; Published: 8-Jun-2000; LatestRevisionDate: 17-Jul-2002; LatestRevisionNote: Re-released for DXP Platform.; PackageReference: AXIAL-0.4; Publisher: Altium Limited; PackageDescription: Axial Device, Thru-Hole; 2 Leads; 0.4 in Pin Spacing

## Sheet IO2.SchDoc
size A4; SheetNumber: 5; SheetTotal: 5
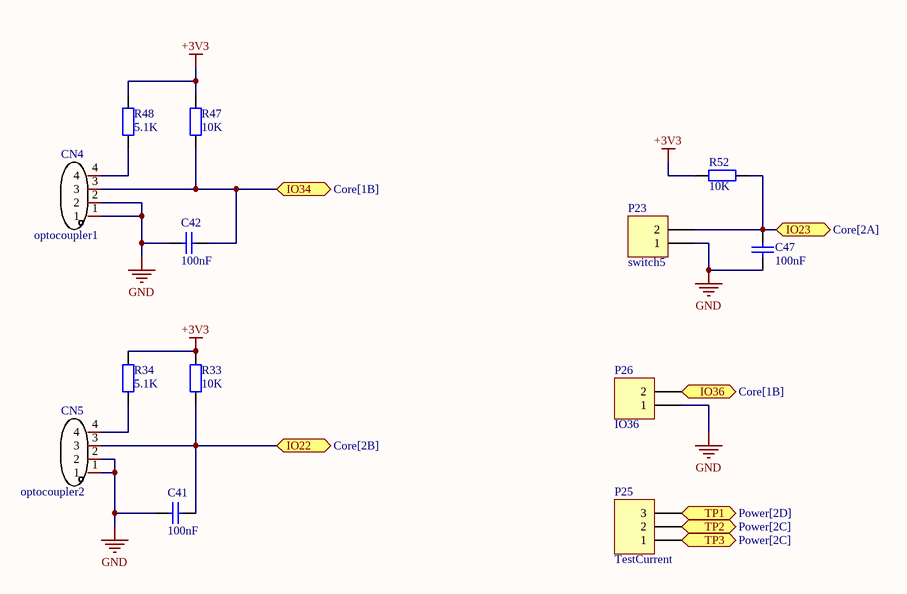
[diagram p4: IO2.SchDoc]

### Parts
C41  value 100nF  [6-0805_N]  (hidden comment: Cap)
C42  value 100nF  [6-0805_N]  (hidden comment: Cap)
C47  value 100nF  [6-0805_N]  (hidden comment: Cap)
CN4  Name: optocoupler1  [CONN-TH_4P-P2.50_4PIN]  (hidden comment: ZX-XH2.54-4PZZ)
CN5  Name: optocoupler2  [CONN-TH_4P-P2.50_4PIN]  (hidden comment: ZX-XH2.54-4PZZ)
P23  switch5  [HDR1X2]
P25  TestCurrent  [HDR1X3]
P26  IO36  [HDR1X2]
R33  value 10K  [6-0805_N]  (hidden comment: Res2)
R34  value 5.1K  [6-0805_N]  (hidden comment: Res2)
R47  value 10K  [6-0805_N]  (hidden comment: Res2)
R48  value 5.1K  [6-0805_N]  (hidden comment: Res2)
R52  value 10K  [6-0805_N]  (hidden comment: Res2)

### Ports
IO22 (bidir, see Core[2B]), IO23 (bidir, see Core[2A]), IO34 (bidir, see Core[1B]), IO36 (bidir, see Core[1B]), TP1 (bidir, see Power[2D]), TP2 (bidir, see Power[2C]), TP3 (bidir, see Power[2C])

### Nets
+3V3: R33.2 R34.2 R47.1 R48.1 R52.1
+12: P25.1 ; port TP3
GND: C41.2 C42.2 C47.1 CN4.1 CN4.2 CN5.1 CN5.2 P23.1 P26.1
NetC20_1: P25.2 ; port TP2
NetC20_2: P25.3 ; port TP1
NetC41_1: C41.1 CN5.3 R33.1 ; port IO22
NetC42_1: C42.1 CN4.3 R47.2 ; port IO34
NetC47_2: C47.2 P23.2 R52.2 ; port IO23
NetCN4_4: CN4.4 R48.2
NetCN5_4: CN5.4 R34.1
NetP26_2: P26.2 ; port IO36

### Library data of the parts
C41 C42 C47 = Cap: Capacitor; Published: 8-Jun-2000; LatestRevisionDate: 17-Jul-2002; LatestRevisionNote: Re-released for DXP Platform.; PackageReference: RAD-0.3; Publisher: Altium Limited; PackageDescription: Radial Cap, Thru-Hole; 2 Leads; 0.3 in Pin Spacing
CN4 CN5 = ZX-XH2.54-4PZZ: as CN3 on sheet Sensor; Symbol: ZX-XH2.54-4PZZ; Device: ZX-XH2.54-4PZZ; LCSC Part Name: ZX-XH2.54-4PZZ; Supplier Part: C7429634; Manufacturer Part: ZX-XH2.54-4PZZ; Supplier Footprint: 插件,P=2.54mm; JLCPCB Part Class: 扩展库; Datasheet: https://atta.szlcsc.com/upload/public/pdf/source/20230619/B529A2163E0159A644AB3383D208FB03.pdf; Supplier: LCSC; Convert to PCB: yes; Mounting Style: 直插; Number of Pins: 4P; Number of Rows: 1; Row Spacing: -; Contact Material: 黄铜; Contact Plating: 锡; Operating Temperature Range: -25℃~+85℃
P23 P26 = Header 2: Header, 2-Pin; LatestRevisionDate: 17-Jul-2002; LatestRevisionNote: Re-released for DXP Platform.; Publisher: Altium Limited
P25 = Header 3: Header, 3-Pin; LatestRevisionDate: 17-Jul-2002; LatestRevisionNote: Re-released for DXP Platform.; Publisher: Altium Limited
R33 R34 R47 R48 R52 = Res2: Resistor; Published: 8-Jun-2000; LatestRevisionDate: 17-Jul-2002; LatestRevisionNote: Re-released for DXP Platform.; PackageReference: AXIAL-0.4; Publisher: Altium Limited; PackageDescription: Axial Device, Thru-Hole; 2 Leads; 0.4 in Pin Spacing

## Nets that join several sheets
+3V3: Core (5 pins), Sensor (9 pins), Power (6 pins), IO (9 pins), IO2 (5 pins)
+5: Sensor (P24.3), Power (12 pins)
+12: Power (11 pins), IO2 (P25.1)
GND: Core (21 pins), Sensor (24 pins), Power (28 pins), IO (15 pins), IO2 (9 pins)
NetC20_1: Power (C20.1 C21.1 R53.1 U6.5), IO2 (P25.2)
NetC20_2: Power (7 pins), IO2 (P25.3)
NetC33_2: Core (U1.26), IO (C33.2 P8.2 R30.2)
NetC34_2: Core (U1.12), IO (C34.2 P9.2 R31.2)
NetC35_2: Core (U1.11), IO (C35.2 P10.2 R32.2)
NetC41_1: Core (U1.36), IO2 (C41.1 CN5.3 R33.1)
NetC42_1: Core (U1.6), IO2 (C42.1 CN4.3 R47.2)
NetC44_2: Core (U1.7), IO (C44.2 P22.2 R46.2)
NetC45_2: Core (U1.29), IO (C45.2 P20.2 R50.2)
NetC47_2: Core (U1.37), IO2 (C47.2 P23.2 R52.2)
NetC51_2: Core (U1.33), IO (C51.2 P21.2 R51.2)
NetP5_1: Core (U1.5), IO (P5.1)
NetP5_2: Sensor (Q3.3 R29.2), IO (P5.2)
NetP6_1: Core (U1.8), IO (P6.1)
NetP6_2: Power (U6.2), IO (P6.2)
NetP7_1: Core (U1.9), IO (P7.1)
NetP7_2: Power (U6.3), IO (P7.2)
NetP14_1: Core (U1.30), IO (P14.1)
NetP16_1: Core (U1.10), IO (P16.1)
NetP18_1: Core (U1.31), IO (P18.1)
NetP26_2: Core (U1.4), IO2 (P26.2)
NetU1_27: Core (U1.27), Sensor (U3.11)
NetU1_28: Core (U1.28), Sensor (U3.12)